# Altium project shoot2.PrjPcb
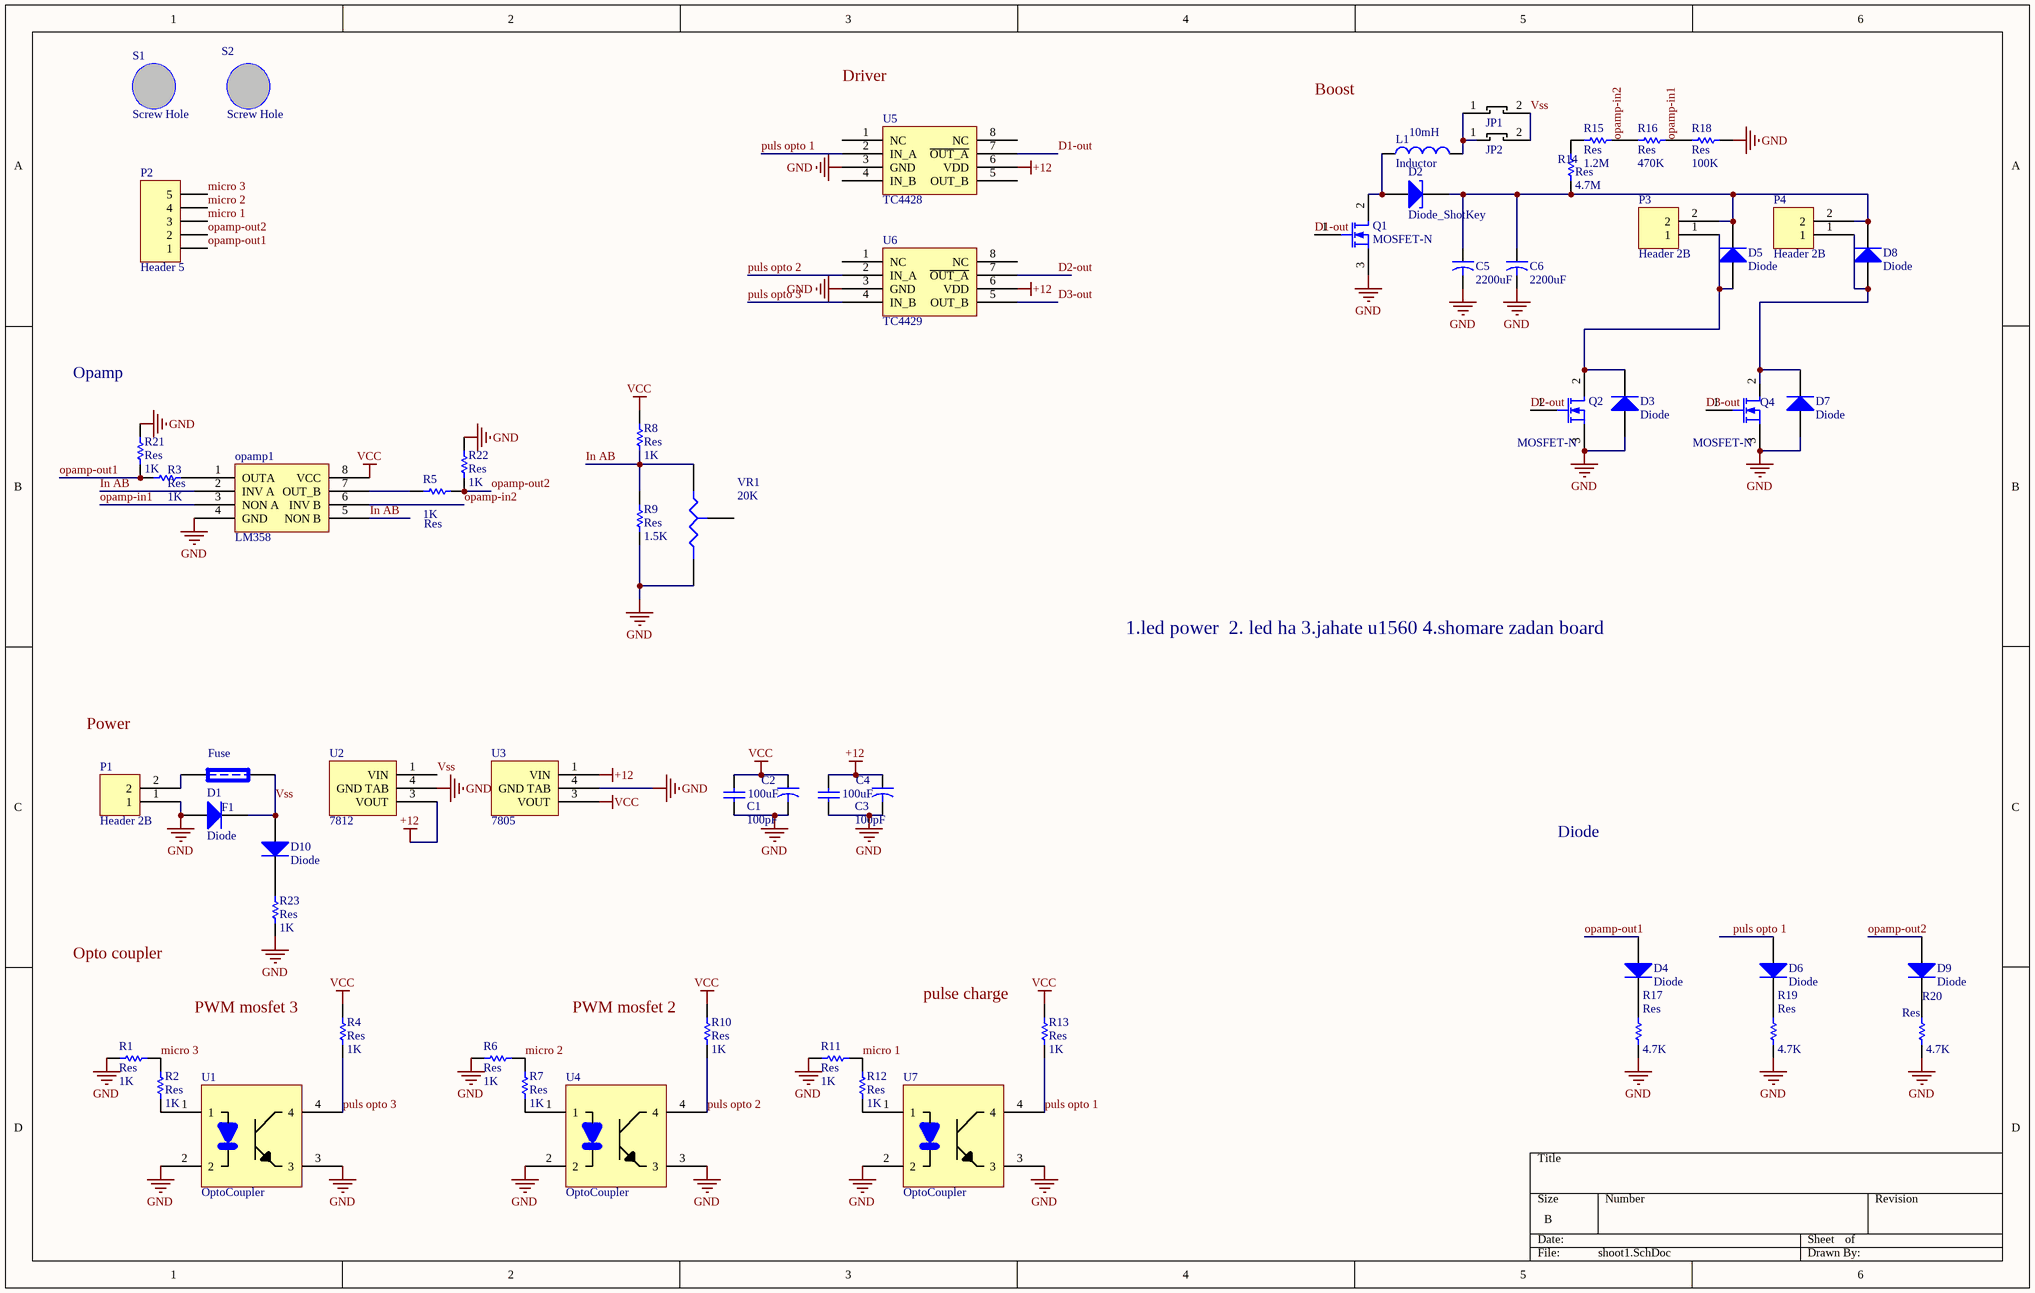
[diagram p0: shoot1.SchDoc]
1 sheet, 61 parts. Net scope: global (net labels, ports and power ports of the same name join across sheets).
Board file: PCB1.PcbDoc

## Sheet shoot1.SchDoc
size B

### Parts
C1  value 100pF  [2012[0805]]  (hidden comment: Cap_UP)
C2  value 100uF  [EL_M]  (hidden comment: Cap_El)
C3  value 100pF  [2012[0805]]  (hidden comment: Cap_UP)
C4  value 100uF  [EL_M]  (hidden comment: Cap_El)
C5  value 2200uF  [CAP]  (hidden comment: Cap_El_200V)
C6  value 2200uF  [CAP]  (hidden comment: Cap_El_200V)
D1  Diode  [US1M]
D2  Diode_ShotKey  [TO-220A - duplicate]
D3  Diode  [DIO10.46-5.3X2.8]
D4  Diode  [2012[0805]]
D5  Diode  [DIO10.46-5.3X2.8]
D6  Diode  [2012[0805]]
D7  Diode  [DIO10.46-5.3X2.8]
D8  Diode  [DIO10.46-5.3X2.8]
D9  Diode  [2012[0805]]
D10  Diode  [2012[0805]]
F1  Fuse  [fuse new]
JP1  JUMPER  [JPR]  (value not drawn)
JP2  JUMPER  [JPR]  (value not drawn)
L1  Inductor  value 10mH  [Mh2]
opamp1  LM358  [8 pin SOIC_N]
P1  Header 2B  [BHDR1X2]
P2  Header 5  [SHEADER 5]
P3  Header 2B  [BHDR1X2]
P4  Header 2B  [BHDR1X2]
Q1  MOSFET-N  [TO247]
Q2  MOSFET-N  [TO247]
Q4  MOSFET-N  [TO247]
R1  Res  value 1K  [2012[0805]]
R2  Res  value 1K  [2012[0805]]
R3  Res  value 1K  [2012[0805]]
R4  Res  value 1K  [2012[0805]]
R5  Res  value 1K  [2012[0805]]
R6  Res  value 1K  [2012[0805]]
R7  Res  value 1K  [2012[0805]]
R8  Res  value 1K  [2012[0805]]
R9  Res  value 1.5K  [2012[0805]]
R10  Res  value 1K  [2012[0805]]
R11  Res  value 1K  [2012[0805]]
R12  Res  value 1K  [2012[0805]]
R13  Res  value 1K  [2012[0805]]
R14  Res  value 4.7M  [2012[0805]]
R15  Res  value 1.2M  [2012[0805]]
R16  Res  value 470K  [2012[0805]]
R17  Res  value 4.7K  [2012[0805]]
R18  Res  value 100K  [2012[0805]]
R19  Res  value 4.7K  [2012[0805]]
R20  Res  value 4.7K  [2012[0805]]
R21  Res  value 1K  [2012[0805]]
R22  Res  value 1K  [2012[0805]]
R23  Res  value 1K  [2012[0805]]
S1  Screw Hole  [Screw Holw 3-6 mm]
S2  Screw Hole  [Screw Holw 3-6 mm]
U1  OptoCoupler  [opto_smd]
U2  7812  [D-PACK]
U3  7805  [D-PACK]
U4  OptoCoupler  [opto_smd]
U5  TC4428  [SO-8_M]
U6  TC4429  [SO-8_M]
U7  OptoCoupler  [opto_smd]
VR1  value 20K  [MULTITURN]  (hidden comment: Res Tap)

### Nets
+12: C3.2 C4.1 U2.3(VOUT) U3.1(VIN) U5.6(VDD) U6.6(VDD)
GND: C1.1 C2.2 C3.1 C4.2 C5.2 C6.2 D1.1(A) D3.1(A) D7.1(A) opamp1.4(GND) P1.1 Q1.3(S) Q2.3(S) Q4.3(S) R1.2 R6.2 R9.1 R11.2 R17.1 R18.1 R19.1 R20.1 R21.2 R22.2 R23.1 U1.2 U1.3 U2.4(GND_TAB) U3.4(GND_TAB) U4.2 U4.3 U5.3(GND) U6.3(GND) U7.2 U7.3 VR1.2(B)
VCC: C1.2 C2.1 opamp1.8(VCC) R4.2 R8.2 R10.2 R13.2 U3.3(VOUT)
D1-out: Q1.1(G) U5.7(~{OUT_A})
D2-out: Q2.1(G) U6.7(~{OUT_A})
D3-out: Q4.1(G) U6.5(OUT_B)
In AB: opamp1.2(INV_A) opamp1.5(NON_B) R8.1 R9.2 VR1.1(A)
micro 1: P2.3 R11.1 R12.2
micro 2: P2.4 R6.1 R7.2
micro 3: P2.5 R1.1 R2.2
opamp-in1: opamp1.3(NON_A) R16.1 R18.2
opamp-in2: opamp1.6(INV_B) R15.1 R16.2
opamp-out1: D4.1(A) P2.1 R3.2 R21.1
opamp-out2: D9.1(A) P2.2 R5.1 R22.1
puls opto 1: D6.1(A) R13.1 U5.2(IN_A) U7.4
puls opto 2: R10.1 U4.4 U6.2(IN_A)
puls opto 3: R4.1 U1.4 U6.4(IN_B)
Vss: D1.2(K) D10.1(A) F1.2 JP1.2 JP2.2 U2.1(VIN)
NetC5_1: C5.1 C6.1 D2.1(K) D5.2(K) D8.2(K) P3.2 P4.2 R14.1
NetD2_2: D2.2(A) L1.1 Q1.2(D)
NetD3_2: D3.2(K) D5.1(A) P3.1 Q2.2(D)
NetD4_2: D4.2(K) R17.2
NetD6_2: D6.2(K) R19.2
NetD7_2: D7.2(K) D8.1(A) P4.1 Q4.2(D)
NetD9_2: D9.2(K) R20.2
NetD10_2: D10.2(K) R23.2
NetF1_1: F1.1 P1.2
NetJP1_1: JP1.1 JP2.1 L1.2
Netopamp1_1: opamp1.1(OUTA) R3.1
Netopamp1_7: opamp1.7(OUT_B) R5.2
NetR2_1: R2.1 U1.1
NetR7_1: R7.1 U4.1
NetR12_1: R12.1 U7.1
NetR14_2: R14.2 R15.2

Not connected (* = marked no-connect by the designer): U5 1(NC) 4(IN_B) 5(OUT_B) 8(NC); U6 1(NC) 8(NC); VR1 3(TAP)

### Notes on the sheet
- Opamp
- 1.led power  2. led ha 3.jahate u1560 4.shomare zadan board
- Diode
- Labels drawn without touching a wire or pin: Boost, Driver, Opto coupler, Power, pulse charge, PWM mosfet 2, PWM mosfet 3

### Library data of the parts
C1 C3 = Cap_UP: Capacitor; Published: 8-Jun-2000; LatestRevisionDate: 17-Jul-2002; LatestRevisionNote: Re-released for DXP Platform.; PackageReference: RAD-0.3; Publisher: Altium Limited
C2 C4 = Cap_El: Capacitor; Published: 23-Sep-2002; PackageReference: CAPR5-4X5; Publisher: Altium Limited
C5 C6 = Cap_El_200V: Capacitor; Published: 23-Sep-2002; PackageReference: CAPR5-4X5; Publisher: Altium Limited
D1 D3-D10 = Diode: 1 Amp General Purpose Rectifier; Revision 1: 11-Jul-2000: SIM Model Added.; Revision 2: 17-Jul-2002: Re-released for DXP Platform.; Package Information: Latest Revision: Aug-1999; Code - JEDEC: DO-204-AL; Published: 8-Jun-2000; Datasheet: Latest Revision: 1998; Package Reference: DO-41; Publisher: Altium Limited
D2 = Diode_ShotKey: 1 Amp General Purpose Rectifier; Revision 1: 11-Jul-2000: SIM Model Added.; Revision 2: 17-Jul-2002: Re-released for DXP Platform.; Package Information: Latest Revision: Aug-1999; Code - JEDEC: DO-204-AL; Published: 8-Jun-2000; Datasheet: Latest Revision: 1998; Package Reference: DO-41; Publisher: Altium Limited
L1 = Inductor: Code_IEC: 1005; Published: 8-Jun-2000; LatestRevisionDate: 17-Jul-2002; LatestRevisionNote: Re-released for DXP Platform.; PackageReference: 0402-A; Publisher: Altium Limited; Code_JEITA: 0402
opamp1 = 7667: Dual MOSFET Driver
P2 = Header 5: Header, 5-Pin; LatestRevisionDate: 17-Jul-2002; LatestRevisionNote: Re-released for DXP Platform.; Publisher: Altium Limited
Q1 Q2 Q4 = MOSFET-N: N-Channel MOSFET; PackageDocument: 1995/1996; Published: 8-Jun-2000; LatestRevisionDate: 17-Jul-2002; LatestRevisionNote: Re-released for DXP Platform.; PackageReference: E3; Publisher: Altium Limited
R1-R23 = Res: Semiconductor Resistor; Published: 8-Jun-2000; LatestRevisionDate: 17-Jul-2002; LatestRevisionNote: Re-released for DXP Platform.; PackageReference: AXIAL-0.5; Publisher: Altium Limited
U1 U4 U7 = TLP521
U5 U6 = TC4428: Dual MOSFET Driver
VR1 = Res Tap: Tapped Resistor; Sim Note: Enter the Resistance value and the set point into parameter fields.; Set Position: 0.5; Published: 24-Mar-1999; LatestRevisionDate: 17-Jul-2002; LatestRevisionNote: Re-released for DXP Platform.; PackageReference: VR3; Publisher: Altium Limited
F1 = Fuse: Published: 8-Jun-2000; LatestRevisionDate: 17-Jul-2002; LatestRevisionNote: Re-released for DXP Platform.; PackageReference: PIN-W2/E2.8; Publisher: Altium Limited